# Altium schematic sheet BLE-HM10.SchDoc
size A4
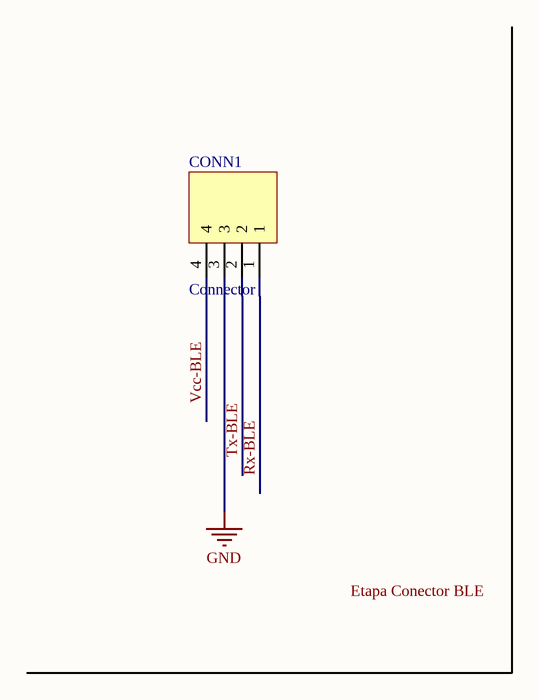
[diagram p0: BLE-HM10.SchDoc]

## Parts
CONN1  Connector  [1x4x2.54 Pin Header TH V]

## Nets
GND: CONN1.3
Rx-BLE: CONN1.1
Tx-BLE: CONN1.2
Vcc-BLE: CONN1.4

## Notes on the sheet
- Labels drawn without touching a wire or pin: Etapa Conector BLE

## Library data of the parts
CONN1 = Header 1x4: Header